# Altium schematic sheet Obstacle Sensors.SchDoc
size A
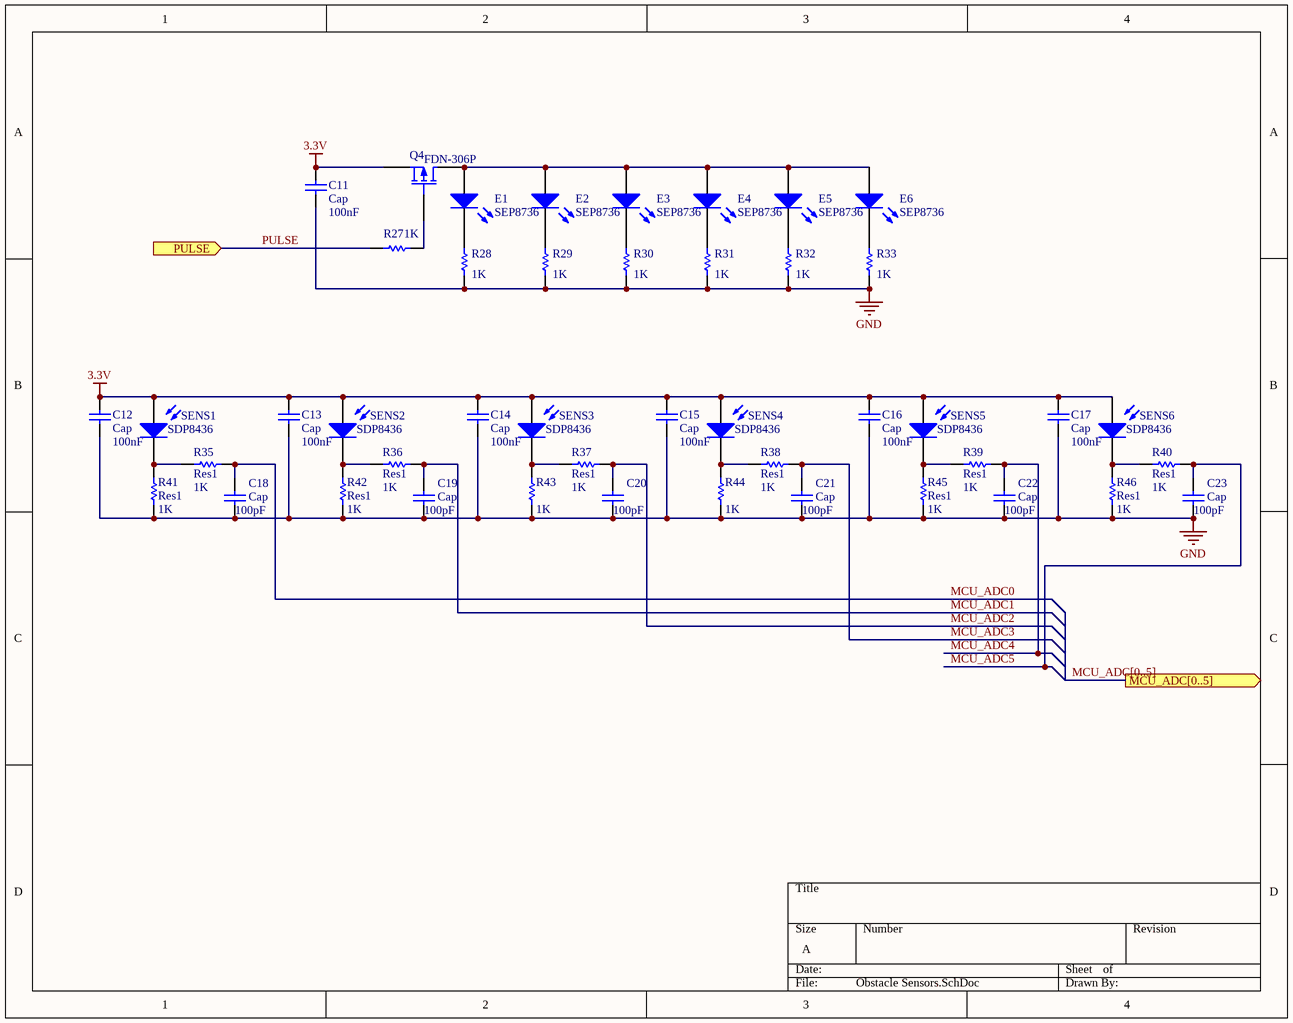
[diagram p0: Obstacle Sensors.SchDoc]

## Parts
C11  Cap  value 100nF  [0603_CAP]
C12  Cap  value 100nF  [0603_CAP]
C13  Cap  value 100nF  [0603_CAP]
C14  Cap  value 100nF  [0603_CAP]
C15  Cap  value 100nF  [0603_CAP]
C16  Cap  value 100nF  [0603_CAP]
C17  Cap  value 100nF  [0603_CAP]
C18  Cap  value 100pF  [0603_CAP]
C19  Cap  value 100pF  [0603_CAP]
C20  value 100pF  [0603_CAP]  (hidden comment: Cap)
C21  Cap  value 100pF  [0603_CAP]
C22  Cap  value 100pF  [0603_CAP]
C23  Cap  value 100pF  [0603_CAP]
E1  SEP8736  [T-1SL]
E2  SEP8736  [T-1SL]
E3  SEP8736  [T-1SL]
E4  SEP8736  [T-1SL]
E5  SEP8736  [T-1SL]
E6  SEP8736  [T-1SL]
Q4  FDN-306P  [SOT-23]
R27  value 1K  [0603_RES]  (hidden comment: Res1)
R28  value 1K  [0603_RES]  (hidden comment: Res1)
R29  value 1K  [0603_RES]  (hidden comment: Res1)
R30  value 1K  [0603_RES]  (hidden comment: Res1)
R31  value 1K  [0603_RES]  (hidden comment: Res1)
R32  value 1K  [0603_RES]  (hidden comment: Res1)
R33  value 1K  [0603_RES]  (hidden comment: Res1)
R35  Res1  value 1K  [0603_RES]
R36  Res1  value 1K  [0603_RES]
R37  Res1  value 1K  [0603_RES]
R38  Res1  value 1K  [0603_RES]
R39  Res1  value 1K  [0603_RES]
R40  Res1  value 1K  [0603_RES]
R41  Res1  value 1K  [0603_RES]
R42  Res1  value 1K  [0603_RES]
R43  value 1K  [0603_RES]  (hidden comment: Res1)
R44  value 1K  [0603_RES]  (hidden comment: Res1)
R45  Res1  value 1K  [0603_RES]
R46  Res1  value 1K  [0603_RES]
SENS1  SDP8436  [T-1SL]
SENS2  SDP8436  [T-1SL]
SENS3  SDP8436  [T-1SL]
SENS4  SDP8436  [T-1SL]
SENS5  SDP8436  [T-1SL]
SENS6  SDP8436  [T-1SL]

## Ports
MCU_ADC[0..5] (out), PULSE (in)

## Nets
3.3V: C11.2 C12.2 C13.2 C14.2 C15.2 C16.2 C17.2 Q4.3(S) SENS1.1(A) SENS2.1(A) SENS3.1(A) SENS4.1(A) SENS5.1(A) SENS6.1(A)
GND: C11.1 C12.1 C13.1 C14.1 C15.1 C16.1 C17.1 C18.1 C19.1 C20.1 C21.1 C22.1 C23.1 R28.1 R29.1 R30.1 R31.1 R32.1 R33.1 R41.1 R42.1 R43.1 R44.1 R45.1 R46.1
MCU_ADC0: C18.2 R35.1
MCU_ADC1: C19.2 R36.1
MCU_ADC2: C20.2 R37.1
MCU_ADC3: C21.2 R38.1
MCU_ADC4: C22.2 R39.1
MCU_ADC5: C23.2 R40.1
PULSE: R27.1 ; port PULSE
NetE1_1: E1.1(A) E2.1(A) E3.1(A) E4.1(A) E5.1(A) E6.1(A) Q4.1(D)
NetE1_2: E1.2(K) R28.2
NetE2_2: E2.2(K) R29.2
NetE3_2: E3.2(K) R30.2
NetE4_2: E4.2(K) R31.2
NetE5_2: E5.2(K) R32.2
NetE6_2: E6.2(K) R33.2
NetQ4_2: Q4.2(G) R27.2
NetR35_2: R35.2 R41.2 SENS1.2(K)
NetR36_2: R36.2 R42.2 SENS2.2(K)
NetR37_2: R37.2 R43.2 SENS3.2(K)
NetR38_2: R38.2 R44.2 SENS4.2(K)
NetR39_2: R39.2 R45.2 SENS5.2(K)
NetR40_2: R40.2 R46.2 SENS6.2(K)

## Buses and harness runs
bus MCU_ADC[0..5] = port MCU_ADC[0..5]

## Library data of the parts
C11-C23 = Cap: Capacitor; Published: 8-Jun-2000; LatestRevisionDate: 17-Jul-2002; LatestRevisionNote: Re-released for DXP Platform.; PackageReference: 0603; Publisher: Altium Limited
E1-E6 = LED0: Typical INFRARED GaAs LED; Published: 8-Jun-2000; LatestRevisionDate: 08-Jul-2005; LatestRevisionNote: Mech Layer 1 removed.; PackageReference: LED-0; Publisher: Altium Limited
Q4 = MOSFET-P: P-Channel MOSFET; pin to pad: 1>3 2>1 3>2; Manufacturer: Fairchild Semiconductor; Manufacturer Part Number: FDN306P; PackageDocument: 1995/1996; Description: MOSFET P-CH 12V 2.6A SSOT3; FET Type: MOSFET P-Channel, Metal Oxide; FET Feature: Logic Level Gate; Rds On (Max) @ Id, Vgs: 40 mOhm @ 2.6A, 4.5V; Drain to Source Voltage (Vdss): 12V; Current - Continuous Drain (Id) @ 25° C: 2.6A; Vgs(th) (Max) @ Id: 1.5V @ 250µA; Gate Charge (Qg) @ Vgs: 17nC @ 4.5V; Input Capacitance (Ciss) @ Vds: 1138pF @ 6V; Power - Max: 460mW; Published: 8-Jun-2000; LatestRevisionDate: 17-Jul-2002; LatestRevisionNote: Re-released for DXP Platform.; PackageReference: E3; Publisher: Altium Limited; Supplier 1: Digi-Key; Supplier Part Number 1: FDN306PCT-ND; RoHS: RoHS Compliant; Category: Discrete Semiconductor Products; Stock 1: 21482; Pricing 1: 1=0.55, 10=0.439, 100=0.3293, 250=0.28444, 500=0.24452, 1000=0.18962 (USD); Mounting Type: Surface Mount; Package / Case: TO-236-3, SC-59, SOT-23-3; Supplier Device Package: 3-SSOT; Packaging: Cut Tape (CT); ComponentLink1URL: http://www.fairchildsemi.com/ds/FD/FDN306P.pdf; ComponentLink1Description: http://www.fairchildsemi.com/ds/FD/FDN306P.pdf
R27-R33 R35-R46 = Res1: Resistor; Published: 8-Jun-2000; LatestRevisionDate: 17-Jul-2002; LatestRevisionNote: Re-released for DXP Platform.; PackageReference: AXIAL-0.3; Publisher: Altium Limited
SENS1-SENS6 = Photo Sen: Photosensitive Diode; Published: 24-Mar-1999; LatestRevisionDate: 17-Jul-2002; LatestRevisionNote: Re-released for DXP Platform.; PackageReference: PIN2; Publisher: Altium Limited